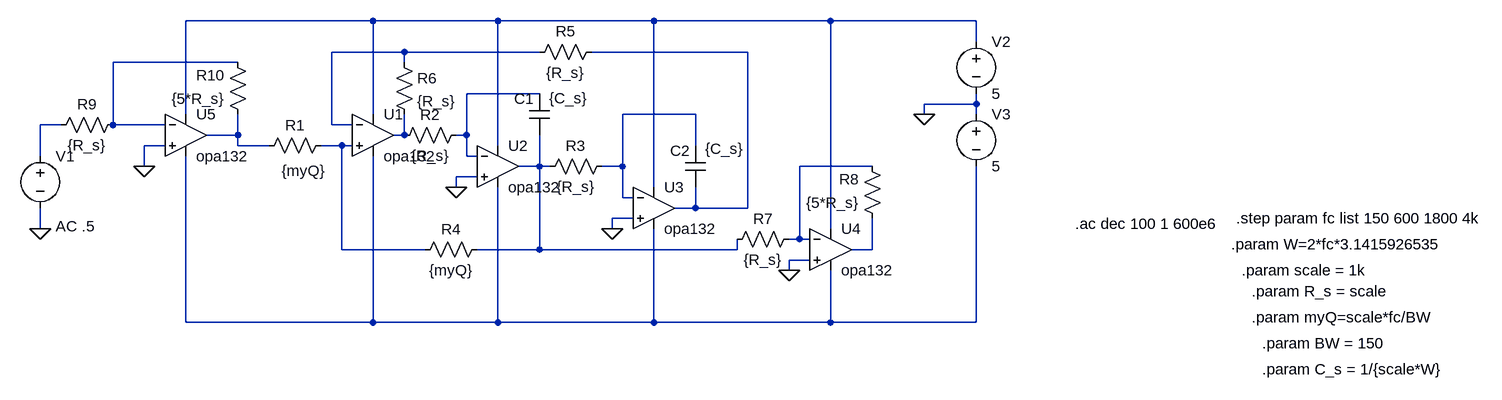
[diagram p0: schematic State_Variable_Filter_NoAmpFeedback.asc]
State_Variable_Filter_NoAmpFeedback.asc, the LTspice schematic file:
Version 4
SHEET 1 1840 680
WIRE 96 -80 -192 -80
WIRE 288 -80 96 -80
WIRE 528 -80 288 -80
WIRE 800 -80 528 -80
WIRE 1024 -80 800 -80
WIRE 1024 -48 1024 -80
WIRE 144 -32 32 -32
WIRE 352 -32 144 -32
WIRE 672 -32 432 -32
WIRE -112 -16 -304 -16
WIRE 144 -16 144 -32
WIRE 352 32 240 32
WIRE 1024 48 1024 32
WIRE 1024 48 944 48
WIRE -192 64 -192 -80
WIRE 96 64 96 -80
WIRE 592 64 480 64
WIRE 944 64 944 48
WIRE 1024 64 1024 48
WIRE -384 80 -416 80
WIRE -304 80 -304 -16
WIRE -224 80 -304 80
WIRE 32 80 32 -32
WIRE 64 80 32 80
WIRE -112 96 -112 64
WIRE -112 96 -160 96
WIRE 144 96 144 64
WIRE 144 96 128 96
WIRE 240 96 240 32
WIRE 240 96 224 96
WIRE -224 112 -256 112
WIRE -112 112 -112 96
WIRE -64 112 -112 112
WIRE 48 112 16 112
WIRE 64 112 48 112
WIRE 288 112 288 -80
WIRE 592 112 592 64
WIRE -416 128 -416 80
WIRE 240 128 240 96
WIRE 256 128 240 128
WIRE -256 144 -256 112
WIRE 352 144 352 96
WIRE 352 144 320 144
WIRE 368 144 352 144
WIRE 480 144 480 64
WIRE 480 144 448 144
WIRE 864 144 752 144
WIRE 256 160 224 160
WIRE 224 176 224 160
WIRE 528 176 528 -80
WIRE 480 192 480 144
WIRE 496 192 480 192
WIRE 592 208 592 176
WIRE 592 208 560 208
WIRE 672 208 672 -32
WIRE 672 208 592 208
WIRE 496 224 464 224
WIRE -416 240 -416 208
WIRE 464 240 464 224
WIRE 800 240 800 -80
WIRE 752 256 752 144
WIRE 752 256 736 256
WIRE 768 256 752 256
WIRE 48 272 48 112
WIRE 176 272 48 272
WIRE 352 272 352 144
WIRE 352 272 256 272
WIRE 656 272 656 256
WIRE 656 272 352 272
WIRE 864 272 864 224
WIRE 864 272 832 272
WIRE 768 288 736 288
WIRE 736 304 736 288
WIRE -192 384 -192 128
WIRE 96 384 96 128
WIRE 96 384 -192 384
WIRE 288 384 288 176
WIRE 288 384 96 384
WIRE 528 384 528 240
WIRE 528 384 288 384
WIRE 800 384 800 304
WIRE 800 384 528 384
WIRE 1024 384 1024 144
WIRE 1024 384 800 384
FLAG 944 64 0
FLAG 224 176 0
FLAG 464 240 0
FLAG 736 304 0
FLAG -256 144 0
FLAG -416 240 0
SYMBOL opa132 96 32 R0
SYMATTR InstName U1
SYMBOL opa132 288 80 R0
SYMATTR InstName U2
SYMBOL opa132 528 144 R0
SYMATTR InstName U3
SYMBOL opa132 800 208 R0
SYMATTR InstName U4
SYMBOL res 32 96 R90
WINDOW 0 0 56 VBottom 2
WINDOW 3 39 43 VTop 2
SYMATTR InstName R1
SYMATTR Value {myQ}
SYMBOL voltage 1024 -64 R0
WINDOW 123 0 0 Left 0
WINDOW 39 0 0 Left 0
SYMATTR InstName V2
SYMATTR Value 5
SYMBOL voltage 1024 48 R0
WINDOW 123 0 0 Left 0
WINDOW 39 0 0 Left 0
SYMATTR InstName V3
SYMATTR Value 5
SYMBOL res 240 80 R90
WINDOW 0 0 56 VBottom 2
WINDOW 3 32 56 VTop 2
SYMATTR InstName R2
SYMATTR Value {R_s}
SYMBOL res 464 128 R90
WINDOW 0 0 56 VBottom 2
WINDOW 3 32 56 VTop 2
SYMATTR InstName R3
SYMATTR Value {R_s}
SYMBOL cap 368 96 R180
WINDOW 0 24 56 Left 2
WINDOW 3 -58 57 Left 2
SYMATTR InstName C1
SYMATTR Value {C_s}
SYMBOL cap 608 176 R180
WINDOW 0 24 56 Left 2
WINDOW 3 -58 59 Left 2
SYMATTR InstName C2
SYMATTR Value {C_s}
SYMBOL res 272 256 R90
WINDOW 0 0 56 VBottom 2
WINDOW 3 32 56 VTop 2
SYMATTR InstName R4
SYMATTR Value {myQ}
SYMBOL res 448 -48 R90
WINDOW 0 0 56 VBottom 2
WINDOW 3 32 56 VTop 2
SYMATTR InstName R5
SYMATTR Value {R_s}
SYMBOL res 128 -32 R0
SYMATTR InstName R6
SYMATTR Value {R_s}
SYMBOL res 752 240 R90
WINDOW 0 0 56 VBottom 2
WINDOW 3 32 56 VTop 2
SYMATTR InstName R7
SYMATTR Value {R_s}
SYMBOL res 880 240 R180
WINDOW 0 36 76 Left 2
WINDOW 3 36 40 Left 2
SYMATTR InstName R8
SYMATTR Value {5*R_s}
SYMBOL opa132 -192 32 R0
SYMATTR InstName U5
SYMBOL res -288 64 R90
WINDOW 0 0 56 VBottom 2
WINDOW 3 32 56 VTop 2
SYMATTR InstName R9
SYMATTR Value {R_s}
SYMBOL res -96 80 R180
WINDOW 0 36 76 Left 2
WINDOW 3 36 40 Left 2
SYMATTR InstName R10
SYMATTR Value {5*R_s}
SYMBOL voltage -416 112 R0
WINDOW 123 24 124 Left 2
WINDOW 39 0 0 Left 0
SYMATTR InstName V1
SYMATTR Value ""
SYMATTR Value2 AC .5
TEXT 1176 232 Left 2 !.ac dec 100 1 600e6
TEXT 1424 224 Left 2 !.step param fc list 150 600 1800 4k
TEXT 1416 264 Left 2 !.param W=2*fc*3.1415926535
TEXT 1432 304 Left 2 !.param scale = 1k
TEXT 1448 336 Left 2 !.param R_s = scale
TEXT 1448 376 Left 2 !.param myQ=scale*fc/BW
TEXT 1464 416 Left 2 !.param BW = 150
TEXT 1464 456 Left 2 !.param C_s = 1/{scale*W}

The netlist it stands for:
* State_Variable_Filter_NoAmpFeedback.asc
* U1: opa132 (symbol opa132 not available, pins judged from their places): In+=N010 In-=N002 V+=N001 V-=N014 OUT=N009
* U2: opa132 (symbol opa132 not available, pins judged from their places): In+=0 In-=N005 V+=N001 V-=N014 OUT=N011
* U3: opa132 (symbol opa132 not available, pins judged from their places): In+=0 In-=N006 V+=N001 V-=N014 OUT=N003
* U4: opa132 (symbol opa132 not available, pins judged from their places): In+=0 In-=N012 V+=N001 V-=N014 OUT=N013
R1 N010 N008 {myQ}
V2 N001 0 5
V3 0 N014 5
R2 N005 N009 {R_s}
R3 N006 N011 {R_s}
C1 N011 N005 {C_s}
C2 N003 N006 {C_s}
R4 N011 N010 {myQ}
R5 N003 N002 {R_s}
R6 N002 N009 {R_s}
R7 N012 N011 {R_s}
R8 N013 N012 {5*R_s}
* U5: opa132 (symbol opa132 not available, pins judged from their places): In+=0 In-=N004 V+=N001 V-=N014 OUT=N008
R9 N004 N007 {R_s}
R10 N008 N004 {5*R_s}
V1 N007 0 AC .5
.ac dec 100 1 600e6
.step param fc list 150 600 1800 4k
.param W=2*fc*3.1415926535
.param scale = 1k
.param R_s = scale
.param myQ=scale*fc/BW
.param BW = 150
.param C_s = 1/{scale*W}
.backanno
.end